# EAGLE design LAm-small (EAGLE 8.1.1)
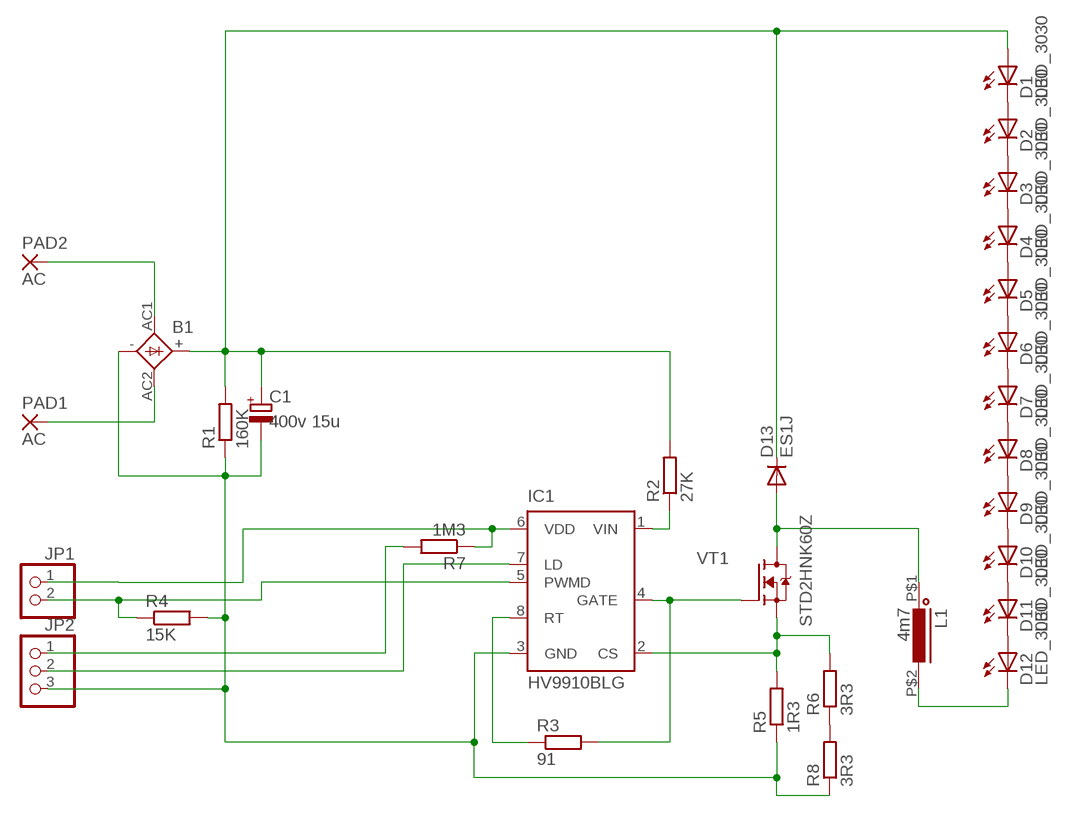
[diagram p0: schematic, sheet 1]

## Parts
B1  BRIDGERB1A  [RB1A]
C1  400v 15u  CAP-POL_E7,5-16  [E7,5-16-32-HORIZ]
D1  LED_3030  [LED3030]
D2  LED_3030  [LED3030]
D3  LED_3030  [LED3030]
D4  LED_3030  [LED3030]
D5  LED_3030  [LED3030]
D6  LED_3030  [LED3030]
D7  LED_3030  [LED3030]
D8  LED_3030  [LED3030]
D9  LED_3030  [LED3030]
D10  LED_3030  [LED3030]
D11  LED_3030  [LED3030]
D12  LED_3030  [LED3030]
D13  ES1J  DIODE_ES1J  [DO214AC]
IC1  HV9910BLG  [SOIC-08LG]
JP1  PINHD-1X2/90  [1X02/90]
JP2  PINHD-1X3/90  [1X03/90]
L1  4m7  INDUCTORSL1016  [SL1016]
PAD1  AC  3,81/1,4  [3,81/1,4]
PAD2  AC  3,81/1,4  [3,81/1,4]
R1  160K  R_MF-0125  [MF-0125]
R2  27K  R_MF-2  [MF-2]
R3  91  R_0805  [R0805]
R4  15K  R_0805  [R0805]
R5  1R3  R_KNP-100B  [KNP-100B]
R6  3R3  R_0805  [R0805]
R7  1M3  R_0805  [R0805]
R8  3R3  R_0805  [R0805]
VT1  STD2HNK60Z  FET-NDPAK  [DPAK]

## Nets
N$1: D1.P$2(C) D2.P$1(A)
N$2: D2.P$2(C) D3.P$1(A)
N$3: D3.P$2(C) D4.P$1(A)
N$4: D4.P$2(C) D5.P$1(A)
N$5: D5.P$2(C) D6.P$1(A)
N$6: D6.P$2(C) D7.P$1(A)
N$7: D7.P$2(C) D8.P$1(A)
N$8: D8.P$2(C) D9.P$1(A)
N$9: D9.P$2(C) D10.P$1(A)
N$10: D10.P$2(C) D11.P$1(A)
N$11: D11.P$2(C) D12.P$1(A)
N$12: B1.AC1 PAD2.1(P)
N$13: B1.AC2 PAD1.1(P)
N$14: B1.- C1.- IC1.3(GND) JP2.3 R1.1 R4.2 R5.1 R8.1
N$16: R6.1 R8.2
N$17: B1.+ C1.+ D1.P$1(A) D13.C R1.2 R2.2
N$18: IC1.1(VIN) R2.1
N$19: IC1.2(CS) R5.2 R6.2 VT1.S
N$20: IC1.8(RT) R3.1
N$21: IC1.4(GATE) R3.2 VT1.G
N$22: D12.P$2(C) L1.P$2
N$23: D13.A L1.P$1 VT1.D
N$24: IC1.5(PWMD) JP1.2 R4.1
N$25: IC1.6(VDD) JP1.1 R7.1
N$28: JP2.1 R7.2
N$29: IC1.7(LD) JP2.2

## Library data of the parts
B1 = Namenlos:BRIDGE: GENERAL INSTRUMENT RECTIFIER
C1 = Namenlos:CAP-POL_
D1-D12 = Namenlos:LED_
D13 = Namenlos:DIODE_
IC1 = Namenlos:HV9910B: Universal High Brightness LED Driver Source: www.supertex.com .. led_driver_ics_SG.pdf; MPN: MXHV9910B; OC_FARNELL: unknown; OC_NEWARK: 15R9731
JP1 = pinhead:PINHD-1X2: PIN HEADER
JP2 = pinhead:PINHD-1X3: PIN HEADER
L1 = Namenlos:INDUCTOR
PAD1 PAD2 = wirepad:3,81/1,4: THROUGH-HOLE PAD
R1-R8 = Namenlos:R_
VT1 = Namenlos:FET-N

## Board
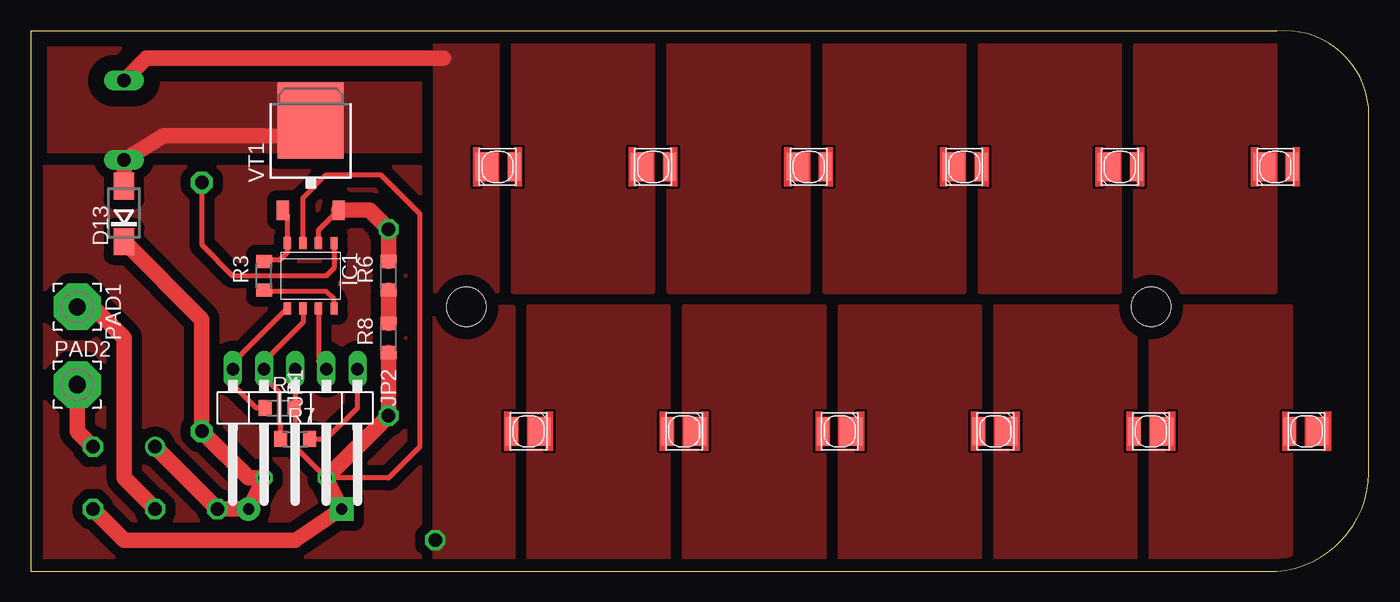
[diagram p1: board, top side]
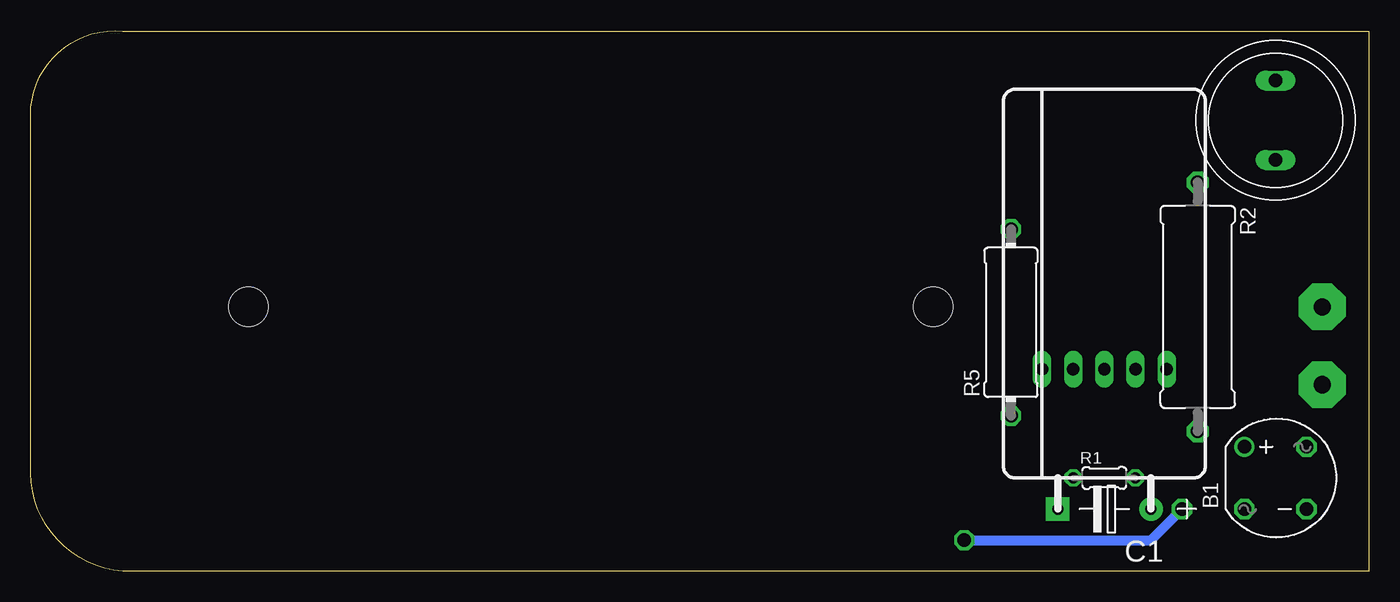
[diagram p2: board, bottom side, seen from below]

Size 109.22 x 44.15 mm. Coordinates in mm from the lower left corner, seen from the top.
Outline: 0,0 101.7,0 arc90 109.2,8.77 109.2,37.89 arc90 101.7,44.12 0,44.12 0,0
Copper layers (1*16): Top 0.035mm / dielectric 1.5mm / Bottom 0.035mm
Design rules "EagleDesignRules": minimum track width 0.2mm, minimum drill 0.3mm, track to track 0.2mm, track to pad 0.2mm, pad to pad 0.2mm, via to via 0.2mm, smd to smd 0.2mm, copper to edge 1mm, drill to drill 0.2mm, minimum pad ring 10mil, minimum via ring 8mil, stop-mask expansion 4mil, vias tented up to drill 0mil, thermal gap 0.25mm
Holes 3.2 mm at 91.44,21.59 35.56,21.59

### Footprints (pad centres in the part's own frame; a part is rotated, then mirrored left to right if it is on the bottom)
RB1A = drill 1.1: + -2.54,2.54 | drill 1.1 octagon: - 2.54,-2.54; AC1 2.54,2.54; AC2 -2.54,-2.54
E7,5-16-32-HORIZ = drill 0.9 pad 1.93: + -3.81,0 | drill 0.9 pad 1.93 square: - 3.81,0
LED3030 = smd 0.965 x 2.27: P$1 -1.393,0 | smd 1.786 x 2.27: P$2 0.897,0
DO214AC = smd 2.2 x 1.7: A 2.25,0; C -2.285,0
SOIC-08LG = smd 0.6 x 1: 1 -1.905,-2.675; 2 -0.635,-2.675; 3 0.635,-2.675; 4 1.905,-2.675; 5 1.905,2.675; 6 0.635,2.675; 7 -0.635,2.675; 8 -1.905,2.675
1X02/90 = drill 1.016 long: 1 -1.27,-3.81; 2 1.27,-3.81
1X03/90 = drill 1.016 long: 1 -2.54,-3.81; 2 0,-3.81; 3 2.54,-3.81
SL1016 = drill 1.1 long: P$1 3.25,0; P$2 -3.25,0
3,81/1,4 = drill 1.397 pad 3.81 octagon: 1 0,0
MF-0125 = drill 0.9 octagon: 1 -2.54,0; 2 2.54,0
MF-2 = drill 1.1 pad 1.778 octagon: 1 -10.16,0; 2 10.16,0
R0805 = smd 1.05 x 1.3: 1 -1.175,0; 2 1.175,0
KNP-100B = drill 1.1 octagon: 1 -7.62,0; 2 7.62,0
DPAK = smd 5.4 x 6.2: D 0,2.5 | smd 1 x 1.6: G -2.28,-4.8; S 2.28,-4.8

### Placement (x,y rotation side)
B1  7.62,7.62 0 bottom
C1  21.59,5.08 180 bottom
D1  40.64,11.43 0 top
D2  53.34,11.43 0 top
D3  66.04,11.43 0 top
D4  78.74,11.43 0 top
D5  91.44,11.43 0 top
D6  104.14,11.43 0 top
D7  101.6,33.02 180 top
D8  88.9,33.02 180 top
D9  76.2,33.02 180 top
D10  63.5,33.02 180 top
D11  50.8,33.02 180 top
D12  38.1,33.02 180 top
D13  7.62,29.21 90 top
IC1  22.86,24.13 180 top
JP1  17.78,12.7 180 top
JP2  24.13,12.7 180 top
L1  7.62,36.83 270 bottom
PAD1  3.81,21.59 270 top
PAD2  3.81,15.24 0 top
R1  21.59,7.62 0 bottom
R2  13.97,21.59 270 bottom
R3  19.05,24.13 90 top
R4  20.32,13.34 0 top
R5  29.21,20.32 90 bottom
R6  29.21,24.13 90 top
R7  21.59,10.79 0 top
R8  29.21,19.05 90 top
VT1  22.86,34.29 0 top

### Tracks (layer width: path | path; a pad name or v marks a point on that pad's centre or on a via)
N$1
  pour Top (no thermals): 40.64,21.59 40.64,0 52.07,0 52.07,21.59
N$2
  pour Top (no thermals): 53.34,21.59 53.34,0 64.77,0 64.77,21.59
N$3
  pour Top (no thermals): 66.04,21.59 66.04,0 77.47,0 77.47,21.59
N$4
  pour Top (no thermals): 78.74,21.59 78.74,0 90.17,0 90.17,21.59
N$5
  pour Top (no thermals): 91.44,21.59 91.44,0 102.87,0 102.87,21.59
N$6
  pour Top (no thermals): 104.14,0 104.14,22.86 102.87,22.86 102.87,44.45 109.22,44.45 109.22,0
N$7
  pour Top (no thermals): 101.6,22.86 101.6,44.45 90.17,44.45 90.17,22.86
N$8
  pour Top (no thermals): 88.9,22.86 88.9,44.45 77.47,44.45 77.47,22.86
N$9
  pour Top (no thermals): 76.2,22.86 76.2,44.45 64.77,44.45 64.77,22.86
N$10
  pour Top (no thermals): 63.5,22.86 63.5,44.45 52.07,44.45 52.07,22.86
N$11
  pour Top (no thermals): 50.8,22.86 50.8,44.45 39.37,44.45 39.37,22.86
N$12
  Top 1.27: PAD2.1 3.81,11.43 B1.AC1
N$13
  Top 1.27: PAD1.1 5.08,21.59 7.62,19.05 7.62,7.62 B1.AC2
N$14
  Top 0.406: IC1.3 22.23,30.48 24.13,32.38 28.57,32.38 31.75,29.21 31.75,10.16 29.21,7.62 R1.1 21.59,10.16 21.59,13.34 21.5,13.43 R4.2 21.59,14.06 JP2.3
  Top 1.27: B1.- 7.62,2.54 21.59,2.54 C1.- R1.1 R5.1 R8.1
N$15
  pour Top (isolate 0.813): 0,33.02 31.75,33.02 31.75,1.27 31.87,0 0,0
N$16
  Top 1.27: R6.1 R8.2
N$17  (via drill 1.1)
  Top 1.27: B1.+ v15.24,5.08 C1.+ R1.2 17.78,7.62 R2.2 13.97,20.57 D13.C
  Bottom 0.813: v33.02,2.54 17.78,2.54 v15.24,5.08
  pour Top (no thermals): 33.02,0 33.02,21.59 39.37,21.59 39.37,0
N$18
  Top 0.406: R2.1 13.97,26.67 16.51,24.13 17.78,24.13 24.13,24.13 24.77,24.77 IC1.1
N$19
  Top 0.406: IC1.2 23.5,27.84 VT1.S
  Top 1.27: VT1.S 27.66,29.49 R5.2 R6.2
N$20
  Top 0.406: IC1.8 24.77,22.23 24.13,22.86 19.14,22.86 R3.1
N$21
  Top 0.406: VT1.G 20.95,29.11 IC1.4 20.95,26.04 20.32,25.4 19.14,25.4 R3.2
N$22
  Top 1.27: L1.P$2 9.45,41.91 33.71,41.91
  pour Top (no thermals): 38.1,22.86 38.1,44.45 33.02,44.45 33.02,22.86
N$23
  Top 1.27: D13.A L1.P$1 10.87,35.56 19.05,35.56 21.63,35.52 VT1.D
  pour Top (isolate 1.27, no thermals): 1.27,34.29 1.27,44.45 31.75,44.45 31.75,34.29
N$24
  Top 0.406: R4.1 18.41,13.34 16.51,15.24 JP1.2 16.51,17.01 IC1.5
N$25
  Top 0.406: R7.1 20.41,11.97 20.32,12.06 20.32,14.61 20,14.92 | 20,14.92 19.68,15.24 | 20,14.92 19.05,15.88 JP1.1 19.05,17.14 22.23,20.32 IC1.6
N$28
  Top 0.406: JP2.1 26.67,13.34 24.13,10.79 R7.2
N$29
  Top 0.406: IC1.7 23.5,17.14 JP2.2